# Altium schematic sheet 21_DAC.SchDoc: DAC
size A3; Organization: Lime Microsystems; Address1: Surrey Tech Centre; Address2: Guildford GU2 7YG; Address3: Surrey; Address4: United Kingdom; Revision: v1.2; SheetNumber: 19; SheetTotal: 27
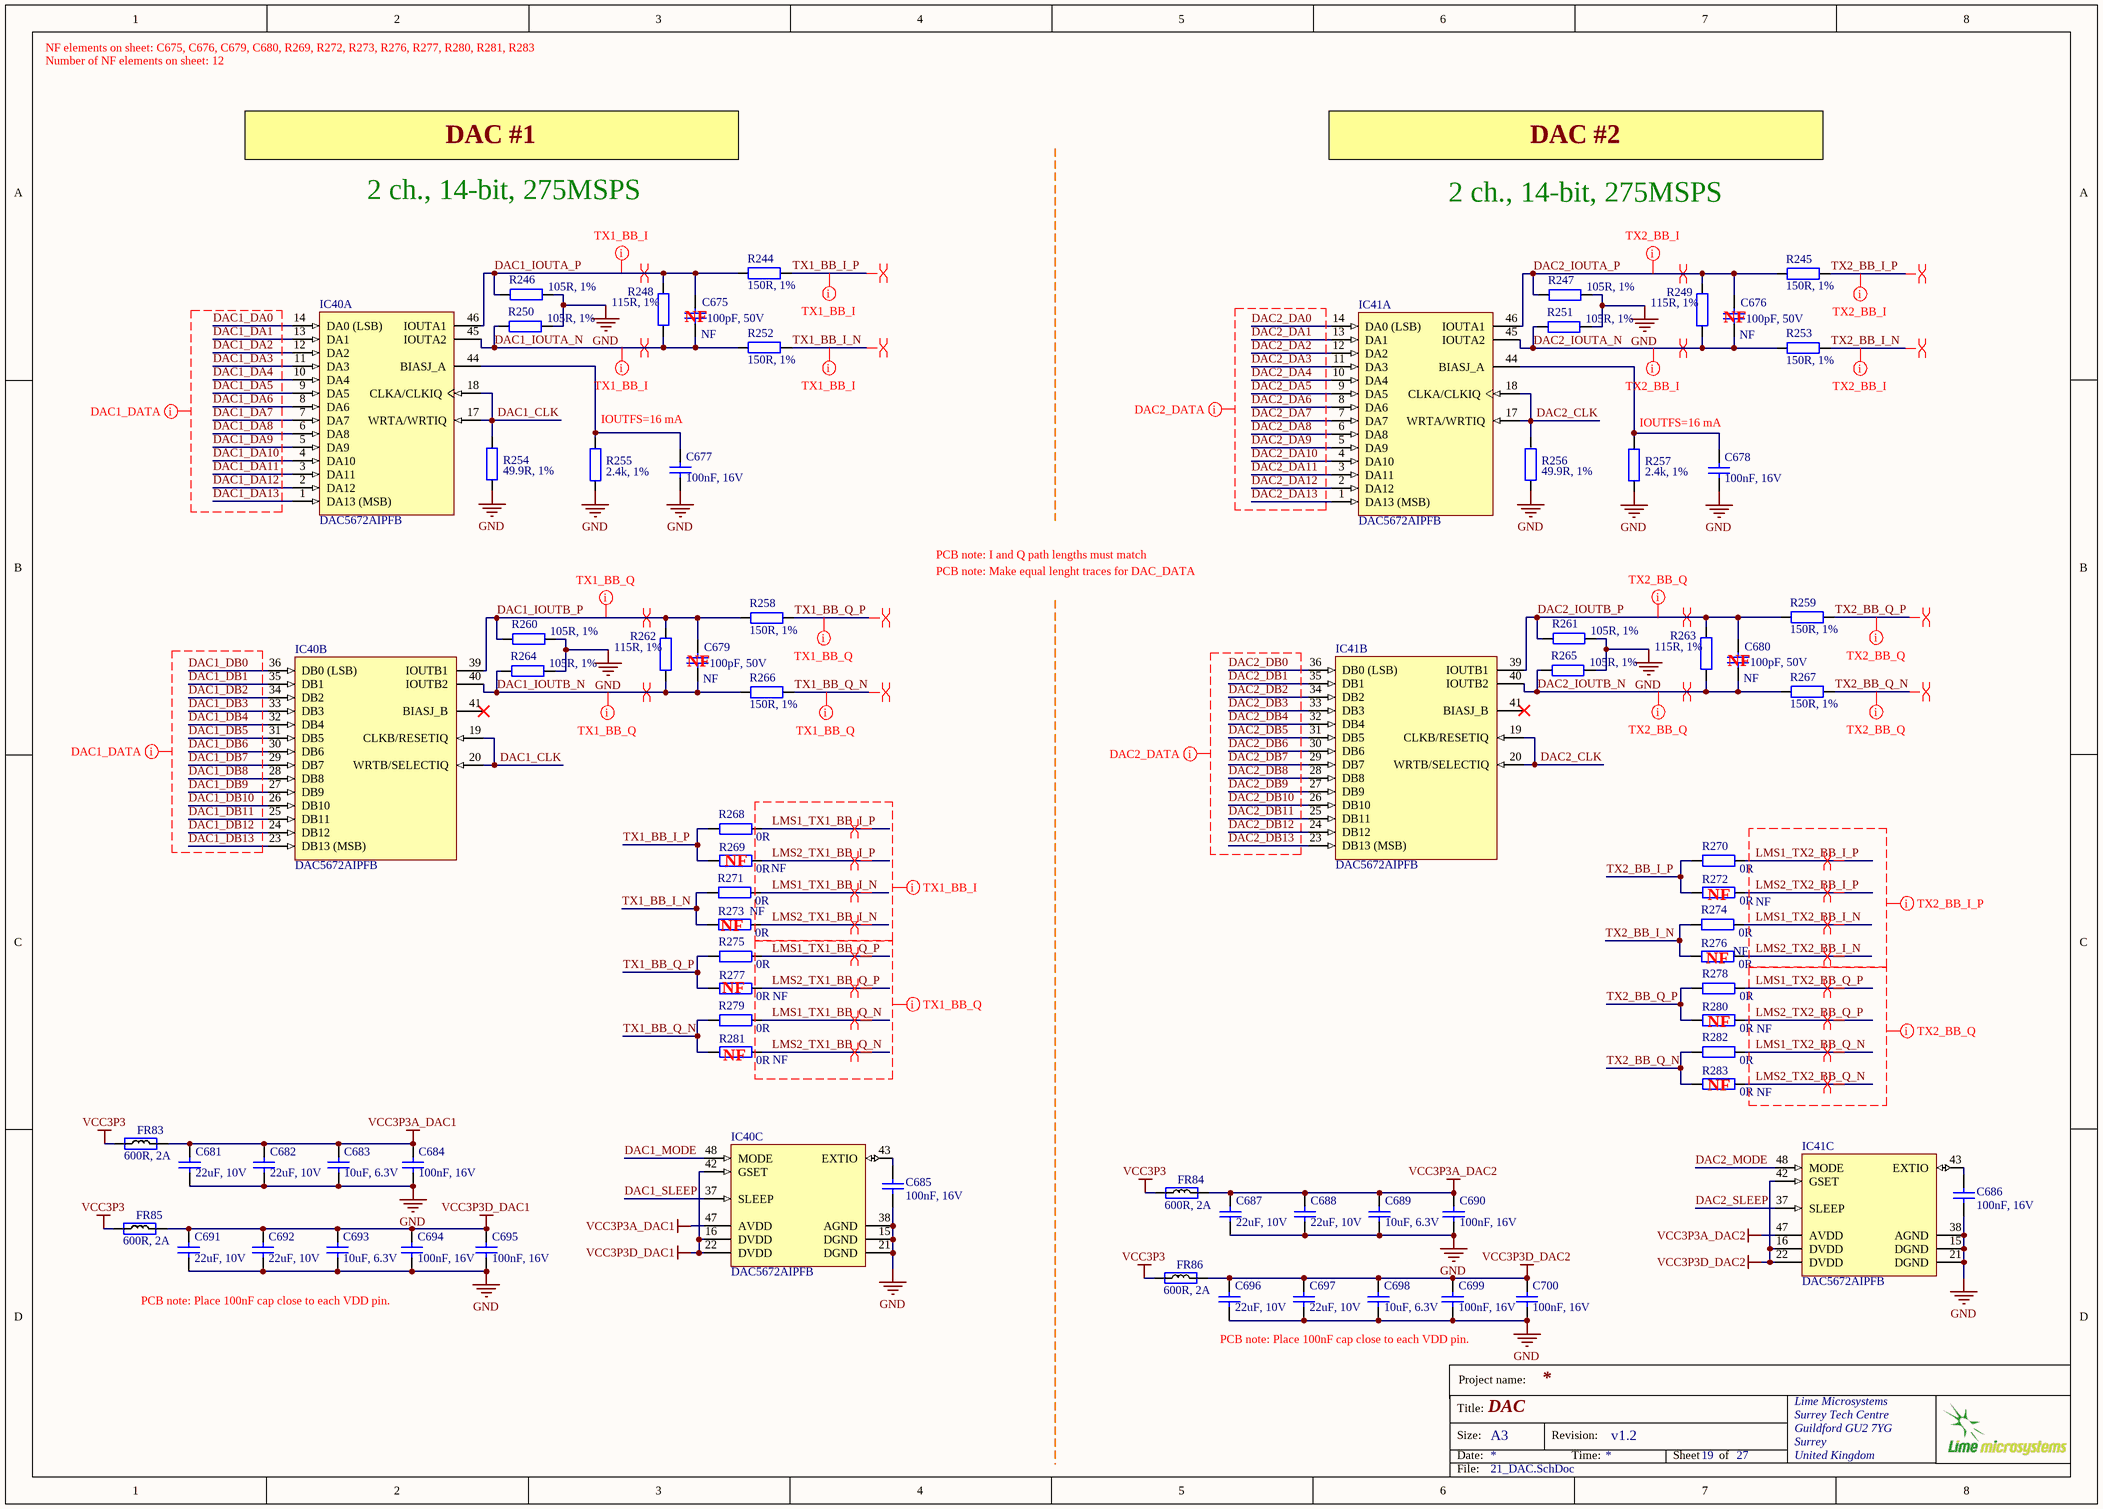
[diagram p0: 21_DAC.SchDoc]

## Parts
C675  100pF, 50V  Assembly Info: NF  [CAP0402]
C676  100pF, 50V  Assembly Info: NF  [CAP0402]
C677  100nF, 16V  [CAP0402]
C678  100nF, 16V  [CAP0402]
C679  100pF, 50V  Assembly Info: NF  [CAP0402]
C680  100pF, 50V  Assembly Info: NF  [CAP0402]
C681  22uF, 10V  [CAP0603]
C682  22uF, 10V  [CAP0603]
C683  10uF, 6.3V  [CAP0603]
C684  100nF, 16V  [CAP0402]
C685  100nF, 16V  [CAP0402]
C686  100nF, 16V  [CAP0402]
C687  22uF, 10V  [CAP0603]
C688  22uF, 10V  [CAP0603]
C689  10uF, 6.3V  [CAP0603]
C690  100nF, 16V  [CAP0402]
C691  22uF, 10V  [CAP0603]
C692  22uF, 10V  [CAP0603]
C693  10uF, 6.3V  [CAP0603]
C694  100nF, 16V  [CAP0402]
C695  100nF, 16V  [CAP0402]
C696  22uF, 10V  [CAP0603]
C697  22uF, 10V  [CAP0603]
C698  10uF, 6.3V  [CAP0603]
C699  100nF, 16V  [CAP0402]
C700  100nF, 16V  [CAP0402]
FR83  600R, 2A  [RES0805]
FR84  600R, 2A  [RES0805]
FR85  600R, 2A  [RES0805]
FR86  600R, 2A  [RES0805]
IC40  DAC5672AIPFB  [TI-PFB48_L]  (parts A,B,C of 3)
IC41  DAC5672AIPFB  [TI-PFB48_L]  (parts A,B,C of 3)
R244  150R, 1%  [RES0402]
R245  150R, 1%  [RES0402]
R246  105R, 1%  [RES0402]
R247  105R, 1%  [RES0402]
R248  115R, 1%  [RES0402]
R249  115R, 1%  [RES0402]
R250  105R, 1%  [RES0402]
R251  105R, 1%  [RES0402]
R252  150R, 1%  [RES0402]
R253  150R, 1%  [RES0402]
R254  49.9R, 1%  [RES0402]
R255  2.4k, 1%  [RES0402]
R256  49.9R, 1%  [RES0402]
R257  2.4k, 1%  [RES0402]
R258  150R, 1%  [RES0402]
R259  150R, 1%  [RES0402]
R260  105R, 1%  [RES0402]
R261  105R, 1%  [RES0402]
R262  115R, 1%  [RES0402]
R263  115R, 1%  [RES0402]
R264  105R, 1%  [RES0402]
R265  105R, 1%  [RES0402]
R266  150R, 1%  [RES0402]
R267  150R, 1%  [RES0402]
R268  0R  [RES0402]
R269  0R  Assembly Info: NF  [RES0402]
R270  0R  [RES0402]
R271  0R  [RES0402]
R272  0R  Assembly Info: NF  [RES0402]
R273  0R  Assembly Info: NF  [RES0402]
R274  0R  [RES0402]
R275  0R  [RES0402]
R276  0R  Assembly Info: NF  [RES0402]
R277  0R  Assembly Info: NF  [RES0402]
R278  0R  [RES0402]
R279  0R  [RES0402]
R280  0R  Assembly Info: NF  [RES0402]
R281  0R  Assembly Info: NF  [RES0402]
R282  0R  [RES0402]
R283  0R  Assembly Info: NF  [RES0402]

## Nets
GND: C677.1 C678.1 C681.1 C682.1 C683.1 C684.1 C685.1 C686.1 C687.1 C688.1 C689.1 C690.1 C691.1 C692.1 C693.1 C694.1 C695.1 C696.1 C697.1 C698.1 C699.1 C700.1 IC40.15(DGND) IC40.21(DGND) IC40.38(AGND) IC41.15(DGND) IC41.21(DGND) IC41.38(AGND) R246.2 R247.2 R250.2 R251.2 R254.1 R255.1 R256.1 R257.1 R260.2 R261.2 R264.2 R265.2
VCC3P3: FR83.1 FR84.1 FR85.1 FR86.1
VCC3P3A_DAC1: C681.2 C682.2 C683.2 C684.2 FR83.2 IC40.47(AVDD)
VCC3P3A_DAC2: C687.2 C688.2 C689.2 C690.2 FR84.2 IC41.47(AVDD)
VCC3P3D_DAC1: C691.2 C692.2 C693.2 C694.2 C695.2 FR85.2 IC40.16(DVDD) IC40.22(DVDD) IC40.42(GSET)
VCC3P3D_DAC2: C696.2 C697.2 C698.2 C699.2 C700.2 FR86.2 IC41.16(DVDD) IC41.22(DVDD) IC41.42(GSET)
DAC1_CLK: IC40.17(WRTA/WRTIQ) IC40.18(CLKA/CLKIQ) IC40.19(CLKB/RESETIQ) IC40.20(WRTB/SELECTIQ) R254.2
DAC1_DA0: IC40.14(DA0_(LSB))
DAC1_DA1: IC40.13(DA1)
DAC1_DA2: IC40.12(DA2)
DAC1_DA3: IC40.11(DA3)
DAC1_DA4: IC40.10(DA4)
DAC1_DA5: IC40.9(DA5)
DAC1_DA6: IC40.8(DA6)
DAC1_DA7: IC40.7(DA7)
DAC1_DA8: IC40.6(DA8)
DAC1_DA9: IC40.5(DA9)
DAC1_DA10: IC40.4(DA10)
DAC1_DA11: IC40.3(DA11)
DAC1_DA12: IC40.2(DA12)
DAC1_DA13: IC40.1(DA13_(MSB))
DAC1_DB0: IC40.36(DB0_(LSB))
DAC1_DB1: IC40.35(DB1)
DAC1_DB2: IC40.34(DB2)
DAC1_DB3: IC40.33(DB3)
DAC1_DB4: IC40.32(DB4)
DAC1_DB5: IC40.31(DB5)
DAC1_DB6: IC40.30(DB6)
DAC1_DB7: IC40.29(DB7)
DAC1_DB8: IC40.28(DB8)
DAC1_DB9: IC40.27(DB9)
DAC1_DB10: IC40.26(DB10)
DAC1_DB11: IC40.25(DB11)
DAC1_DB12: IC40.24(DB12)
DAC1_DB13: IC40.23(DB13_(MSB))
DAC1_IOUTA_N: C675.2 IC40.45(IOUTA2) R248.2 R250.1 R252.1
DAC1_IOUTA_P: C675.1 IC40.46(IOUTA1) R244.1 R246.1 R248.1
DAC1_IOUTB_N: C679.2 IC40.40(IOUTB2) R262.2 R264.1 R266.1
DAC1_IOUTB_P: C679.1 IC40.39(IOUTB1) R258.1 R260.1 R262.1
DAC1_MODE: IC40.48(MODE)
DAC1_SLEEP: IC40.37(SLEEP)
DAC2_CLK: IC41.17(WRTA/WRTIQ) IC41.18(CLKA/CLKIQ) IC41.19(CLKB/RESETIQ) IC41.20(WRTB/SELECTIQ) R256.2
DAC2_DA0: IC41.14(DA0_(LSB))
DAC2_DA1: IC41.13(DA1)
DAC2_DA2: IC41.12(DA2)
DAC2_DA3: IC41.11(DA3)
DAC2_DA4: IC41.10(DA4)
DAC2_DA5: IC41.9(DA5)
DAC2_DA6: IC41.8(DA6)
DAC2_DA7: IC41.7(DA7)
DAC2_DA8: IC41.6(DA8)
DAC2_DA9: IC41.5(DA9)
DAC2_DA10: IC41.4(DA10)
DAC2_DA11: IC41.3(DA11)
DAC2_DA12: IC41.2(DA12)
DAC2_DA13: IC41.1(DA13_(MSB))
DAC2_DB0: IC41.36(DB0_(LSB))
DAC2_DB1: IC41.35(DB1)
DAC2_DB2: IC41.34(DB2)
DAC2_DB3: IC41.33(DB3)
DAC2_DB4: IC41.32(DB4)
DAC2_DB5: IC41.31(DB5)
DAC2_DB6: IC41.30(DB6)
DAC2_DB7: IC41.29(DB7)
DAC2_DB8: IC41.28(DB8)
DAC2_DB9: IC41.27(DB9)
DAC2_DB10: IC41.26(DB10)
DAC2_DB11: IC41.25(DB11)
DAC2_DB12: IC41.24(DB12)
DAC2_DB13: IC41.23(DB13_(MSB))
DAC2_IOUTA_N: C676.2 IC41.45(IOUTA2) R249.2 R251.1 R253.1
DAC2_IOUTA_P: C676.1 IC41.46(IOUTA1) R245.1 R247.1 R249.1
DAC2_IOUTB_N: C680.2 IC41.40(IOUTB2) R263.2 R265.1 R267.1
DAC2_IOUTB_P: C680.1 IC41.39(IOUTB1) R259.1 R261.1 R263.1
DAC2_MODE: IC41.48(MODE)
DAC2_SLEEP: IC41.37(SLEEP)
LMS1_TX1_BB_I_N: R271.1
LMS1_TX1_BB_I_P: R268.1
LMS1_TX1_BB_Q_N: R279.1
LMS1_TX1_BB_Q_P: R275.1
LMS1_TX2_BB_I_N: R274.1
LMS1_TX2_BB_I_P: R270.1
LMS1_TX2_BB_Q_N: R282.1
LMS1_TX2_BB_Q_P: R278.1
LMS2_TX1_BB_I_N: R273.1
LMS2_TX1_BB_I_P: R269.1
LMS2_TX1_BB_Q_N: R281.1
LMS2_TX1_BB_Q_P: R277.1
LMS2_TX2_BB_I_N: R276.1
LMS2_TX2_BB_I_P: R272.1
LMS2_TX2_BB_Q_N: R283.1
LMS2_TX2_BB_Q_P: R280.1
TX1_BB_I_N: R252.2 R271.2 R273.2
TX1_BB_I_P: R244.2 R268.2 R269.2
TX1_BB_Q_N: R266.2 R279.2 R281.2
TX1_BB_Q_P: R258.2 R275.2 R277.2
TX2_BB_I_N: R253.2 R274.2 R276.2
TX2_BB_I_P: R245.2 R270.2 R272.2
TX2_BB_Q_N: R267.2 R282.2 R283.2
TX2_BB_Q_P: R259.2 R278.2 R280.2
NetC677_2: C677.2 IC40.44(BIASJ_A) R255.2
NetC678_2: C678.2 IC41.44(BIASJ_A) R257.2
NetC685_2: C685.2 IC40.43(EXTIO)
NetC686_2: C686.2 IC41.43(EXTIO)

Not connected (* = marked no-connect by the designer): IC40 41(BIASJ_B)*; IC41 41(BIASJ_B)*

## Layout directives
net class DAC1_DATA: DAC1_DA0, DAC1_DA1, DAC1_DA2, DAC1_DA3, DAC1_DA4, DAC1_DA5, DAC1_DA6, DAC1_DA7, DAC1_DA8, DAC1_DA9, DAC1_DA10, DAC1_DA11, DAC1_DA12, DAC1_DA13, DAC1_DB0, DAC1_DB1, DAC1_DB2, DAC1_DB3, DAC1_DB4, DAC1_DB5, DAC1_DB6, DAC1_DB7, DAC1_DB8, DAC1_DB9, DAC1_DB10, DAC1_DB11, DAC1_DB12, DAC1_DB13
net class DAC2_DATA: DAC2_DA0, DAC2_DA1, DAC2_DA2, DAC2_DA3, DAC2_DA4, DAC2_DA5, DAC2_DA6, DAC2_DA7, DAC2_DA8, DAC2_DA9, DAC2_DA10, DAC2_DA11, DAC2_DA12, DAC2_DA13, DAC2_DB0, DAC2_DB1, DAC2_DB2, DAC2_DB3, DAC2_DB4, DAC2_DB5, DAC2_DB6, DAC2_DB7, DAC2_DB8, DAC2_DB9, DAC2_DB10, DAC2_DB11, DAC2_DB12, DAC2_DB13
differential pair: DAC1_IOUTA_N, DAC1_IOUTA_P, DAC1_IOUTB_N, DAC1_IOUTB_P, DAC2_IOUTA_N, DAC2_IOUTA_P, DAC2_IOUTB_N, DAC2_IOUTB_P, LMS1_TX1_BB_I_N, LMS1_TX1_BB_I_P, LMS1_TX1_BB_Q_N, LMS1_TX1_BB_Q_P, LMS1_TX2_BB_I_N, LMS1_TX2_BB_I_P, LMS1_TX2_BB_Q_N, LMS1_TX2_BB_Q_P, LMS2_TX1_BB_I_N, LMS2_TX1_BB_I_P, LMS2_TX1_BB_Q_N, LMS2_TX1_BB_Q_P, LMS2_TX2_BB_I_N, LMS2_TX2_BB_I_P, LMS2_TX2_BB_Q_N, LMS2_TX2_BB_Q_P, TX1_BB_I_N, TX1_BB_I_P, TX1_BB_Q_N, TX1_BB_Q_P, TX2_BB_I_N, TX2_BB_I_P, TX2_BB_Q_N, TX2_BB_Q_P
net class TX1_BB_I: DAC1_IOUTA_N, DAC1_IOUTA_P, LMS1_TX1_BB_I_N, LMS1_TX1_BB_I_P, LMS2_TX1_BB_I_N, LMS2_TX1_BB_I_P, TX1_BB_I_N, TX1_BB_I_P
net class TX1_BB_Q: DAC1_IOUTB_N, DAC1_IOUTB_P, LMS1_TX1_BB_Q_N, LMS1_TX1_BB_Q_P, LMS2_TX1_BB_Q_N, LMS2_TX1_BB_Q_P, TX1_BB_Q_N, TX1_BB_Q_P
net class TX2_BB_I: DAC2_IOUTA_N, DAC2_IOUTA_P, TX2_BB_I_N, TX2_BB_I_P
net class TX2_BB_Q: DAC2_IOUTB_N, DAC2_IOUTB_P, LMS1_TX2_BB_Q_N, LMS1_TX2_BB_Q_P, LMS2_TX2_BB_Q_N, LMS2_TX2_BB_Q_P, TX2_BB_Q_N, TX2_BB_Q_P
net class TX2_BB_I_P: LMS1_TX2_BB_I_N, LMS1_TX2_BB_I_P, LMS2_TX2_BB_I_N, LMS2_TX2_BB_I_P

## Notes on the sheet
- NF elements on sheet: C675, C676, C679, C680, R269, R272, R273, R276, R277, R280, R281, R283
- Number of NF elements on sheet: 12
- DAC #1
- DAC #2
- 2 ch., 14-bit, 275MSPS
- (near C675) NF
- (near C676) NF
- IOUTFS=16 mA
- (near R257) IOUTFS=16 mA
- PCB note: Make equal lenght traces for DAC_DATA
- PCB note: I and Q path lengths must match
- (near C679) NF
- (near C680) NF
- (near R269) NF
- (near R272) NF
- (near R273) NF
- (near R277) NF
- (near R276) NF
- (near R280) NF
- (near R281) NF
- (near R283) NF
- PCB note: Place 100nF cap close to each VDD pin.
- Project name:
- Title:
- Size:
- Date:
- A3
- Revision:
- Time:
- Sheet
- of
- File:

## Library data of the parts
C675 C676 C679 C680 = Cap_0402: Manufacturer Part Number 1: CC0402JRNPO9BN101; Manufacturer: Yageo; Part Description: 100pF ±5% 50V C0G, NP0 Ceramic Capacitor -55°C ~ 125°C Surface Mount, MLCC 0402 (1005 Metric) 0.039" L x 0.020" W (1.00mm x 0.50mm); Tolerance: ±5%; Temperature Coefficient: C0G, NP0; Value: 100pF, 50V; Capacitance: 100pF; Thickness (Max): 0.022" (0.55mm); Size / Dimension: 0.039" L x 0.020" W (1.00mm x 0.50mm); RoHS: RoHS Compliant; Ratings: -; Package / Case: 0402 (1005 Metric); Mounting Type: Surface Mount, MLCC; Height - Seated (Max): -; Features: -; Lead Spacing: -; Voltage - Rated: 50V; Operating Temperature: -55°C ~ 125°C; Packaging: Cut Tape (CT); Applications: General Purpose; Lead Style: -; Supplier 1: Digi-Key; Category: Capacitors; Supplier Part Number 1: 311-1024-1-ND
C677 C678 C684-C686 C690 C694 C695 C699 C700 = Cap_0603: Part Description: 0.10µF ±10% 16V Ceramic Capacitor X7R 0402 (1005 Metric); Manufacturer Part Number 1: GRM155R71C104KA88D; Brand: Murata Electronics; Tolerance: 10 %; Type: General Purpose MLCC; Capacitance: 0.1 uF; Temperature Coefficient / Code: +/- 15 %; Case Height: 0.5 mm; Case Length: 1 mm; Dielectric: X7R; Supplier 1: Mouser; Supplier Part Number 1: 81-GRM155R71C104KA88; Case Code - in: 0402; Manufacturer: Murata Electronics; Category: Multilayer Ceramic Capacitors MLCC - SMD/SMT; Voltage Rating DC: 16 V; Value: 100nF, 16V; Case Code - mm: 1005; Case Width: 0.5 mm; Manufacturer Part Number: GRM155R71C104KA88D; Maximum Operating Temperature: + 125 C; Minimum Operating Temperature: - 55 C; Minimum Order Quantity: 1; Operating Temperature Range: - 55 C to + 125 C; Package / Case: 0402 (1005 metric); Packaging: Reel; Product: General Type MLCCs; Product Category: Low & Medium Capacitance SMD Ceramic Chip Capacitors; Reeling: True; RoHS - Mouser: Y; RoHS: RoHS Compliant; Series: GRM; Standard Pack Qty: 10000; Termination Style: SMD/SMT
C681 C682 C687 C688 C691 C692 C696 C697 = Cap_0603: Manufacturer Part Number 1: C1608X5R1A226M080AC; Part Description: 22µF ±20% 10V Ceramic Capacitor X5R 0603 (1608 Metric); Manufacturer: TDK Corporation; Brand: TDK; Temperature Coefficient / Code: +/- 15 %; Tolerance: 20 %; Type: Multilayer Ceramic Chip Capacitor; Supplier 1: Mouser; Supplier Part Number 1: 810-C1608X5R1A226M; Package / Case: 0603 (1608 metric); Category: Multilayer Ceramic Capacitors MLCC - SMD/SMT; Capacitance: 22 uF; Operating Temperature Range: - 55 C to + 85 C; Case Code - in: 0603; Voltage Rating DC: 10 V; Case Code - mm: 1608; Value: 22uF, 10V
C683 C689 C693 C698 = Cap_0603: Manufacturer Part Number 1: CC0603MRX5R5BB106; Part Description: 10µF ±20% 6.3V Ceramic Capacitor X5R 0603 (1608 Metric); Manufacturer: Yageo; Capacitance: 10µF, 6.3V; Tolerance: ±20%; Supplier 1: Digi-Key; Supplier Part Number 1: 311-1448-2-ND; Package / Case: 0603 (1608 Metric); Category: Capacitors; Voltage - Rated: 6.3V; Value: 10uF, 6.3V
FR83-FR86 = Ferrite: Manufacturer Part Number 1: MPZ2012S601A; Manufacturer: TDK; Part Description: FERRITE BEAD 600 OHM 0805 1LN; Impedance Tolerance: ± 25%; Impedance @ 100MHz: 600; Ferrite Mounting: SMD; DC Resistance Max: 0.1; DC Current Rating: 2; Ferrite Case Style: 0805 [2012 Metric]; DC Resistance (DCR): 100 mOhm Max; Filter Type: Differential Mode - Single; Impedance @ Frequency: 600 Ohm @ 100MHz; Supplier 1: Farnell; Supplier Part Number 1: 1669753RL; Supplier: Farnell; Core Material: Ferrite; Value: 600R, 2A; Category: Filters; Current Rating: 2A; Height (Max): 0.041" (1.05mm); Mounting Type: Surface Mount; Package / Case: 0805 (2012 Metric); Packaging: Tape & Reel (TR); RoHS: RoHS Compliant; Size / Dimension: 0.079" L x 0.049" W (2.00mm x 1.25mm)
IC40 IC41 = DAC5672AIPFB: 14-Bit 275 MSPS Dual Digital to Analog Converter, -40 to 85 degC, 48-pin QFP (PFB48), Green (RoHS & no Sb/Br); Manufacturer: Texas Instruments; Part Description: 14 Bit Digital to Analog Converter 2 48-TQFP (7x7); DAC Channels: 2; DNL(Max)(+/-LSB): 3; INL(Max)(+/-LSB): 4; Interface: Parallel CMOS; Power Consumption(Typ)(mW): 330; Resolution(Bits): 14; Settling Time(us): 0.02; SFDR(dB): 84; SNR(dB): 77; SubFamily: High Speed DAC (>10MSPS); DatasheetVersion: SLAS528A; PackageVersion: 4073176/B, 10/1996; PackageReference: PFB48; PackageDescription: 48-Pin Plastic Flat Pack, Body 7 x 7 mm, Pitch 0.5 mm; Supplier 1: Digi-Key; Supplier Part Number 1: 296-22616-ND; Supplier 2: Newark; Supplier Part Number 2: 58M0323; Supplier 3: Mouser; Supplier Part Number 3: 595-DAC5672AIPFB; Eco-Plan: Green (RoHS & no Sb/Br); Mounting Technology: Surface Mount; Code_JEDEC: MS-026; PartNumber: DAC5672AIPFB; ComponentLink1Description: Manufacturer URL; ComponentLink1URL: http://www.ti.com/; ComponentLink2Description: Datasheet; ComponentLink2URL: http://www.ti.com/general/docs/lit/getliterature.tsp?genericPartNumber=DAC5672A&fileType=pdf; ComponentLink3Description: Package Specification; ComponentLink3URL: http://www.ti.com/lit/ml/mtqf019a/mtqf019a.pdf
  IC40: Manufacturer Part Number 1: DAC5672AIPFB
R244 R245 R252 R253 R258 R259 R266 R267 = Res_0402: Manufacturer: Yageo; Part Description: RES SMD 150 OHM 1% 1/16W 0402; Manufacturer Part Number 1: RC0402FR-07150RL; Temperature Coefficient: ±100ppm/°C; Resistance (Ohms): 150; Power (Watts): 0.063W, 1/16W; Packaging: Cut Tape (CT); Category: Resistors; Height: 0.016" (0.40mm); Supplier Part Number 1: 311-150LRCT-ND; RoHS: RoHS Compliant; Operating Temperature: -55°C ~ 155°C; Number of Terminations: 2; Package / Case: 0402 (1005 Metric); Supplier 1: Digi-Key; Supplier Device Package: 0402; Size / Dimension: 0.039" L x 0.020" W (1.00mm x 0.50mm); Features: Moisture Resistant; Composition: Thick Film; Tolerance: ±1%; Value: 150R, 1%
R246 R247 R250 R251 R260 R261 R264 R265 = Res_0402: Manufacturer: Yageo; Part Description: RES SMD 105 OHM 1% 1/16W 0402; Manufacturer Part Number 1: RC0402FR-07105RL; Power (Watts): 0.063W, 1/16W; Resistance (Ohms): 105; Temperature Coefficient: ±100ppm/°C; Category: Resistors; Packaging: Cut Tape (CT); Package / Case: 0402 (1005 Metric); Size / Dimension: 0.039" L x 0.020" W (1.00mm x 0.50mm); Height: 0.016" (0.40mm); Supplier Device Package: 0402; Number of Terminations: 2; RoHS: RoHS Compliant; Composition: Thick Film; Supplier 1: Digi-Key; Features: Moisture Resistant; Tolerance: ±1%; Supplier Part Number 1: YAG2947CT-ND; Operating Temperature: -55°C ~ 155°C; Value: 105R, 1%
R248 R249 R262 R263 = Res_0402: Manufacturer: Yageo; Part Description: RES SMD 115 OHM 1% 1/16W 0402; Manufacturer Part Number 1: RC0402FR-07115RL; Power (Watts): 0.063W, 1/16W; Resistance (Ohms): 115; Temperature Coefficient: ±100ppm/°C; Features: Moisture Resistant; Number of Terminations: 2; Supplier 1: Digi-Key; Height: 0.016" (0.40mm); Supplier Part Number 1: YAG2957CT-ND; Packaging: Cut Tape (CT); Tolerance: ±1%; Category: Resistors; Composition: Thick Film; Package / Case: 0402 (1005 Metric); Supplier Device Package: 0402; Size / Dimension: 0.039" L x 0.020" W (1.00mm x 0.50mm); RoHS: RoHS Compliant; Operating Temperature: -55°C ~ 155°C; Value: 115R, 1%
R254 R256 = Res_0402: Manufacturer: Samsung Electro-Mechanics America, Inc.; Part Description: RES SMD 49.9 OHM 1% 1/16W 0402; Manufacturer Part Number 1: RC1005F49R9CS; Temperature Coefficient: ±100ppm/°C; Resistance (Ohms): 49.9; Power (Watts): 0.063W, 1/16W; Number of Terminations: 2; Size / Dimension: 0.039" L x 0.020" W (1.00mm x 0.50mm); Supplier Device Package: 0402 (1005 Metric); RoHS: RoHS Compliant; Supplier Part Number 1: 1276-3469-6-ND; Features: -; Packaging: Digi-Reel®; Tolerance: ±1%; Height: 0.016" (0.40mm); Category: Resistors; Composition: Thick Film; Package / Case: 0402 (1005 Metric); Supplier 1: Digi-Key; Operating Temperature: -55°C ~ 155°C; Value: 49.9R, 1%
R255 R257 = Res_0402: Manufacturer Part Number: RC0402FR-072K4L; Manufacturer: Yageo; Part Description: 2.4 kOhms ±1% 0.063W, 1/16W Chip Resistor 0402 (1005 Metric) Moisture Resistant Thick Film; Temperature Coefficient: ±100ppm/°C; Power (Watts): 0.063W, 1/16W; Value: 2.4k, 1%; Package / Case: 0402 (1005 Metric); RoHS: RoHS Compliant; Supplier Part Number 1: 311-2.40KLRCT-ND; Resistance (Ohms): 2.4k; Size / Dimension: 0.039" L x 0.020" W (1.00mm x 0.50mm); Category: Resistors; Part Status: Active; Features: Moisture Resistant; Supplier Device Package: 0402; Failure Rate: -; Tolerance: ±1%; Composition: Thick Film; Packaging: Cut Tape (CT); Operating Temperature: -55°C ~ 155°C; Height - Seated (Max): 0.016" (0.40mm); Supplier 1: Digi-Key
R268-R283 = Res_0402: Manufacturer: Yageo; Part Description: RES SMD 0.0OHM JUMPER 1/16W 0402; Manufacturer Part Number 1: RC0402JR-070RL; Supplier 1: Digi-Key; Supplier Part Number 1: 311-0.0JRTR-ND; Composition: Thick Film; Package / Case: 0402 (1005 Metric); Category: Resistors; Value: 0R